# Altium project Energy Monitoring System.PrjPcb
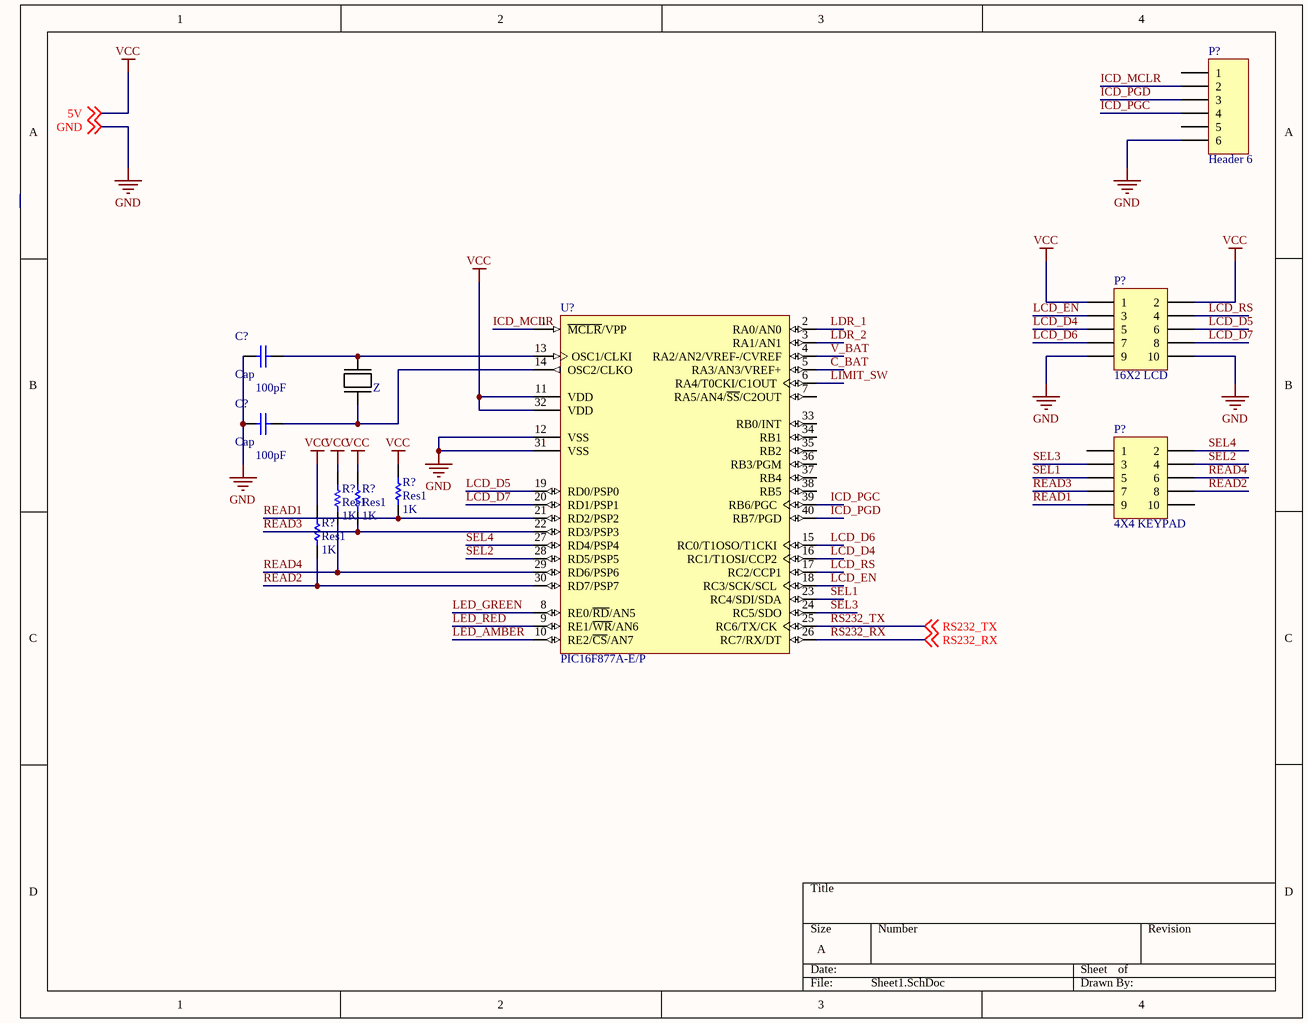
[diagram p0: Sheet1.SchDoc]
3 sheets, 26 parts. Net scope: global (net labels, ports and power ports of the same name join across sheets).
Sheets:
  Sheet1.SchDoc
  RS232.SchDoc
  POWER_SECTION.SchDoc

## Sheet Sheet1.SchDoc
size A

### Parts
(Parts that share a designator on the sheet are numbered #1, #2 ... from top to bottom, then left to right.)
C?#1  Cap  value 100pF  [RAD-0.3]
C?#2  Cap  value 100pF  [RAD-0.3]
P?#1  Header 6  [HDR1X6]
P?#2  16X2 LCD  [HDR2X5]
P?#3  4X4 KEYPAD  [HDR2X5]
R?#1  Res1  value 1K  [AXIAL-0.3]
R?#2  Res1  value 1K  [AXIAL-0.3]
R?#3  Res1  value 1K  [AXIAL-0.3]
R?#4  Res1  value 1K  [AXIAL-0.3]
U?#1  PIC16F877A-E/P  [PDIP600-P40]
Z  CRYSTAL  (value not drawn)

### Nets
5V: P?#2.1 P?#2.2 R?#1.2 R?#2.2 R?#3.2 R?#4.2 U?#1.11(VDD) U?#1.32(VDD) ; off-sheet 5V  [also labelled VCC]
GND: C?#1.1 C?#2.1 P?#1.6 P?#2.9 P?#2.10 U?#1.12(VSS) U?#1.31(VSS) ; off-sheet GND
C_BAT: U?#1.5(RA3/AN3/VREF+)
ICD_MCLR: P?#1.2 U?#1.1(~{MCLR}/VPP)
ICD_PGC: P?#1.4 U?#1.39(RB6/PGC)
ICD_PGD: P?#1.3 U?#1.40(RB7/PGD)
LCD_D4: P?#2.5 U?#1.16(RC1/T1OSI/CCP2)
LCD_D5: P?#2.6 U?#1.19(RD0/PSP0)
LCD_D6: P?#2.7 U?#1.15(RC0/T1OSO/T1CKI)
LCD_D7: P?#2.8 U?#1.20(RD1/PSP1)
LCD_EN: P?#2.3 U?#1.18(RC3/SCK/SCL)
LCD_RS: P?#2.4 U?#1.17(RC2/CCP1)
LDR_1: U?#1.2(RA0/AN0)
LDR_2: U?#1.3(RA1/AN1)
LED_AMBER: U?#1.10(RE2/~{CS}/AN7)
LED_GREEN: U?#1.8(RE0/~{RD}/AN5)
LED_RED: U?#1.9(RE1/~{WR}/AN6)
LIMIT_SW: U?#1.6(RA4/T0CKI/C1OUT)
READ1: P?#3.9 R?#1.1 U?#1.21(RD2/PSP2)
READ2: P?#3.8 R?#4.1 U?#1.30(RD7/PSP7)
READ3: P?#3.7 R?#3.1 U?#1.22(RD3/PSP3)
READ4: P?#3.6 R?#2.1 U?#1.29(RD6/PSP6)
RS232_RX: U?#1.26(RC7/RX/DT) ; off-sheet RS232_RX
RS232_TX: U?#1.25(RC6/TX/CK) ; off-sheet RS232_TX
SEL1: P?#3.5 U?#1.23(RC4/SDI/SDA)
SEL2: P?#3.4 U?#1.28(RD5/PSP5)
SEL3: P?#3.3 U?#1.24(RC5/SDO)
SEL4: P?#3.2 U?#1.27(RD4/PSP4)
V_BAT: U?#1.4(RA2/AN2/VREF-/CVREF)
NetC?#1_2: C?#1.2 U?#1.13(OSC1/CLKI) Z.1
NetC?#2_2: C?#2.2 U?#1.14(OSC2/CLKO) Z.22

Not connected (* = marked no-connect by the designer): P?#1 1 5; P?#3 1 10; U?#1 7(RA5/AN4/~{SS}/C2OUT) 33(RB0/INT) 34(RB1) 35(RB2) 36(RB3/PGM) 37(RB4) 38(RB5)

### Library data of the parts
C?#1 C?#2 = Cap: Capacitor; Published: 8-Jun-2000; LatestRevisionDate: 17-Jul-2002; LatestRevisionNote: Re-released for DXP Platform.; PackageReference: RAD-0.3; Publisher: Altium Limited; PackageDescription: Radial Cap, Thru-Hole; 2 Leads; 0.3 in Pin Spacing
P?#1 = Header 6: Header, 6-Pin; LatestRevisionDate: 17-Jul-2002; LatestRevisionNote: Re-released for DXP Platform.; Publisher: Altium Limited
P?#2 P?#3 = Header 5X2: Header, 5-Pin, Dual row; LatestRevisionDate: 17-Jul-2002; LatestRevisionNote: Re-released for DXP Platform.; Publisher: Altium Limited
R?#1-R?#4 = Res1: Resistor; Published: 8-Jun-2000; LatestRevisionDate: 17-Jul-2002; LatestRevisionNote: Re-released for DXP Platform.; PackageReference: AXIAL-0.3; Publisher: Altium Limited; PackageDescription: Axial Device, Thru-Hole; 2 Leads; 0.3 in Pin Spacing
U?#1 = PIC16F877A-E/P: Enhanced FLASH Microcontroller, 8K (x14-Bit words) FLASH, 368 Bytes RAM, 40-Pin PDIP, Standard VDD Range, Extended Temperature; ComponentAvailability: Unknown. Contact manufacturer to determine status.; Published: 11-Oct-2004; LatestRevisionDate: 29-Jan-2009; LatestRevisionNote: Sch. layout revised. 3D Model Removed.; DatasheetVersion: revB, Oct-2003; PackageVersion: revBB, Aug-2009; PackageReference: PDIP600-P40; Publisher: Altium Limited; PackageDescription: 40-Lead Plastic Dual In-Line (P) - 600 mil Body [PDIP]; Supplier 1: Digi-Key; Supplier Part Number 1: PIC16F877A-E/P-ND; Supplier 2: Farnell; Supplier Part Number 2: 1567990; ComponentLink1Description: Datasheet; ComponentLink1URL: http://ww1.microchip.com/downloads/en/DeviceDoc/39582b.pdf; ComponentLink2Description: Packaging Specification; ComponentLink2URL: http://www.microchip.com/stellent/groups/techpub_sg/documents/packagingspec/en012702.pdf; ComponentLink3Description: Microchip.com Home; ComponentLink3URL: http://www.microchip.com/

## Sheet RS232.SchDoc
size A
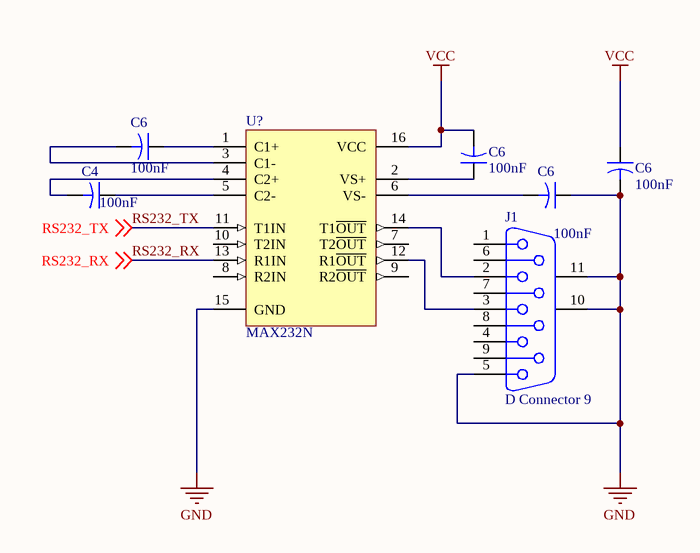
[diagram p1: RS232.SchDoc]

### Parts
(Parts that share a designator on the sheet are numbered #1, #2 ... from top to bottom, then left to right.)
C4  value 100nF  [0805]  (hidden comment: Cap2)
C6#1  value 100nF  [0805]  (hidden comment: Cap2)
C6#2  value 100nF  [0805]  (hidden comment: Cap2)
C6#3  value 100nF  [0805]  (hidden comment: Cap2)
C6#4  value 100nF  [0805]  (hidden comment: Cap2)
J1  D Connector 9  [DSUB1.385-2H9]
U?#2  MAX232N  [N016]

### Nets
GND: C6#3.2 C6#4.1 J1.5 J1.10(MH1) J1.11(MH2) U?#2.15(GND)
VCC: C6#2.2 C6#3.1 U?#2.16(VCC)  [project net 5V]
RS232_RX: U?#2.13(R1IN) ; off-sheet RS232_RX
RS232_TX: U?#2.11(T1IN) ; off-sheet RS232_TX
NetC4_1: C4.1 U?#2.5(C2-)
NetC4_2: C4.2 U?#2.4(C2+)
NetC6#1_1: C6#1.1 U?#2.1(C1+)
NetC6#1_2: C6#1.2 U?#2.3(C1-)
NetC6#2_1: C6#2.1 U?#2.2(VS+)
NetC6#4_2: C6#4.2 U?#2.6(VS-)
NetJ1_2: J1.2 U?#2.14(T1~{OUT})
NetJ1_3: J1.3 U?#2.12(R1~{OUT})

Not connected (* = marked no-connect by the designer): J1 1 4 6 7 8 9; U?#2 7(T2~{OUT}) 8(R2IN) 9(R2~{OUT}) 10(T2IN)

### Library data of the parts
C4 C6#1-C6#4 = Cap2: Capacitor; Published: 23-Sep-2002; PackageReference: CAPR5-4X5; Publisher: Altium Limited
J1 = D Connector 9: Receptacle Assembly, 9 Position, Right Angle; PackageDocument: O; Positions: 9; Published: 15-Jun-2001; LatestRevisionDate: 17-Jul-2002; LatestRevisionNote: Re-released for DXP Platform.; DatasheetDocument: 1-Sep-1999; PackageReference: 788750; Publisher: Altium Limited; Orientation: Right Angle; Gender: Receptacle
U?#2 = MAX232N: Dual EIA-232 Driver/Receiver; Note: Receivers have typical hysteresis of 0.5V; Published: 15-May-2002; LatestRevisionDate: 04-Mar-2005; LatestRevisionNote: Stylized 3D Model Added.; DatasheetVersion: Jun-1989; PackageVersion: Oct-1995; PackageReference: N016; Publisher: Altium Limited; PackageDescription: DIP; 16 Leads; Row Spacing 7.62 mm; Pitch 2.54 mm; Code_JEDEC: MS-001-BB; ComponentLink1Description: Manufacturer Link; ComponentLink1URL: http://www.ti.com/; ComponentLink2Description: Datasheet; ComponentLink2URL: http://www-s.ti.com/sc/ds/max232.pdf

## Sheet POWER_SECTION.SchDoc
size A
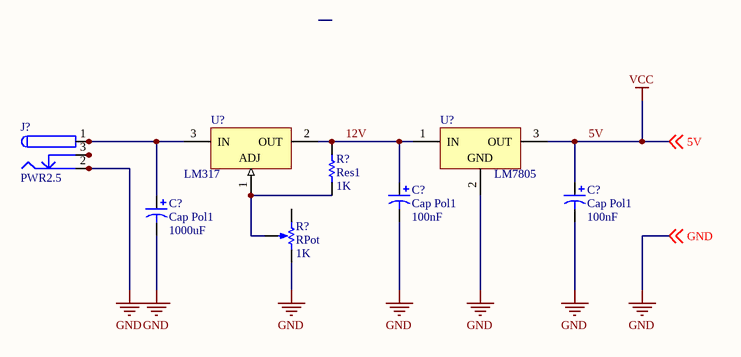
[diagram p2: POWER_SECTION.SchDoc]

### Parts
(Parts that share a designator on the sheet are numbered #1, #2 ... from top to bottom, then left to right.)
C?#3  Cap Pol1  value 100nF  [RB7.6-15]
C?#4  Cap Pol1  value 100nF  [RB7.6-15]
C?#5  Cap Pol1  value 1000uF  [RB7.6-15]
J?  PWR2.5  [KLD-0202]
R?#5  Res1  value 1K  [AXIAL-0.3]
R?#6  RPot  value 1K  [VR5]
U?#3  LM317  [KC03]
U?#4  LM7805  [KC03]

### Nets
5V: C?#4.1 U?#4.3(OUT) ; off-sheet 5V  [also labelled VCC]
GND: C?#3.2 C?#4.2 C?#5.2 J?.2 J?.2A J?.2B R?#6.2(BOT) U?#4.2(GND) ; off-sheet GND
12V: C?#3.1 R?#5.2 U?#3.2(OUT) U?#4.1(IN)
NetC?#5_1: C?#5.1 J?.1 J?.1A J?.1B U?#3.3(IN)
NetJ?_3: J?.3 J?.3A J?.3B
NetR?#5_1: R?#5.1 R?#6.3(TAP) U?#3.1(ADJ)

Not connected (* = marked no-connect by the designer): R?#6 1(TOP)

### Library data of the parts
C?#3-C?#5 = Cap Pol1: Polarized Capacitor (Radial); Published: 8-Jun-2000; LatestRevisionDate: 17-Jul-2002; LatestRevisionNote: Re-released for DXP Platform.; PackageReference: RB7.6-15; Publisher: Altium Limited; PackageDescription: Polarized Capacitor (Radial); 2 Leads
J? = PWR2.5: Low Voltage Power Supply Connector; Published: 17-Dec-2003; DatasheetDocument: 09-May-2002; Publisher: Altium Limited; ComponentLink1Description: Manufacturer Link; ComponentLink1URL: http://domino.kycon.com/internet/Products.html
R?#5 = Res1: Resistor; Published: 8-Jun-2000; LatestRevisionDate: 17-Jul-2002; LatestRevisionNote: Re-released for DXP Platform.; PackageReference: AXIAL-0.3; Publisher: Altium Limited; PackageDescription: Axial Device, Thru-Hole; 2 Leads; 0.3 in Pin Spacing
R?#6 = RPot: Potentiometer; Sim Note: Enter the Resistance value and the set point into parameter fields.; Set Position: 0.5; Published: 8-Jun-2000; LatestRevisionDate: 17-Jul-2002; LatestRevisionNote: Re-released for DXP Platform.; PackageReference: VR5; Publisher: Altium Limited; PackageDescription: Variable Resistor, Thru-Hole; 3 Leads
U?#3 = LM317KC: 3-Terminal Adjustable Regulator; Note: Pin 2 is electrically connected to tab; Published: 15-Apr-2002; DatasheetVersion: Feb-1988; PackageVersion: Sep-1995; PackageReference: KC03; Publisher: Altium Limited; PackageDescription: TO, Thru-Hole, Vertical, Heatsink Mounted; 3 In-Line Leads; Pitch 2.54 mm; ComponentLink1Description: Manufacturer Link; ComponentLink1URL: http://www.ti.com/
U?#4 = µA7805CKC: Positive-Voltage Regulator; Note: Pin 2 is electrically connected to TAB.; Published: 15-Apr-2002; DatasheetVersion: Jul-1999; PackageVersion: Sep-1995; PackageReference: KC03; Publisher: Altium Limited; PackageDescription: TO, Thru-Hole, Vertical, Heatsink Mounted; 3 In-Line Leads; Pitch 2.54 mm; ComponentLink1Description: Manufacturer Link; ComponentLink1URL: http://www.ti.com/; ComponentLink2Description: Datasheet; ComponentLink2URL: http://www-s.ti.com/sc/ds/ua7805.pdf

## Nets that join several sheets
5V: Sheet1 (8 pins), RS232 (C6#2.2 C6#3.1 U?#2.16), POWER_SECTION (C?#4.1 U?#4.3)
GND: Sheet1 (7 pins), RS232 (6 pins), POWER_SECTION (8 pins)
RS232_RX: Sheet1 (U?#1.26), RS232 (U?#2.13)
RS232_TX: Sheet1 (U?#1.25), RS232 (U?#2.11)